# Altium schematic sheet BoardSchematic.SchDoc: Encoder DAQ
size A4; Date: March 16, 2022; Author: NIschay Joshi; CompanyName: UBC ECE; Revision: 1.0; SheetNumber: 1; SheetTotal: 1
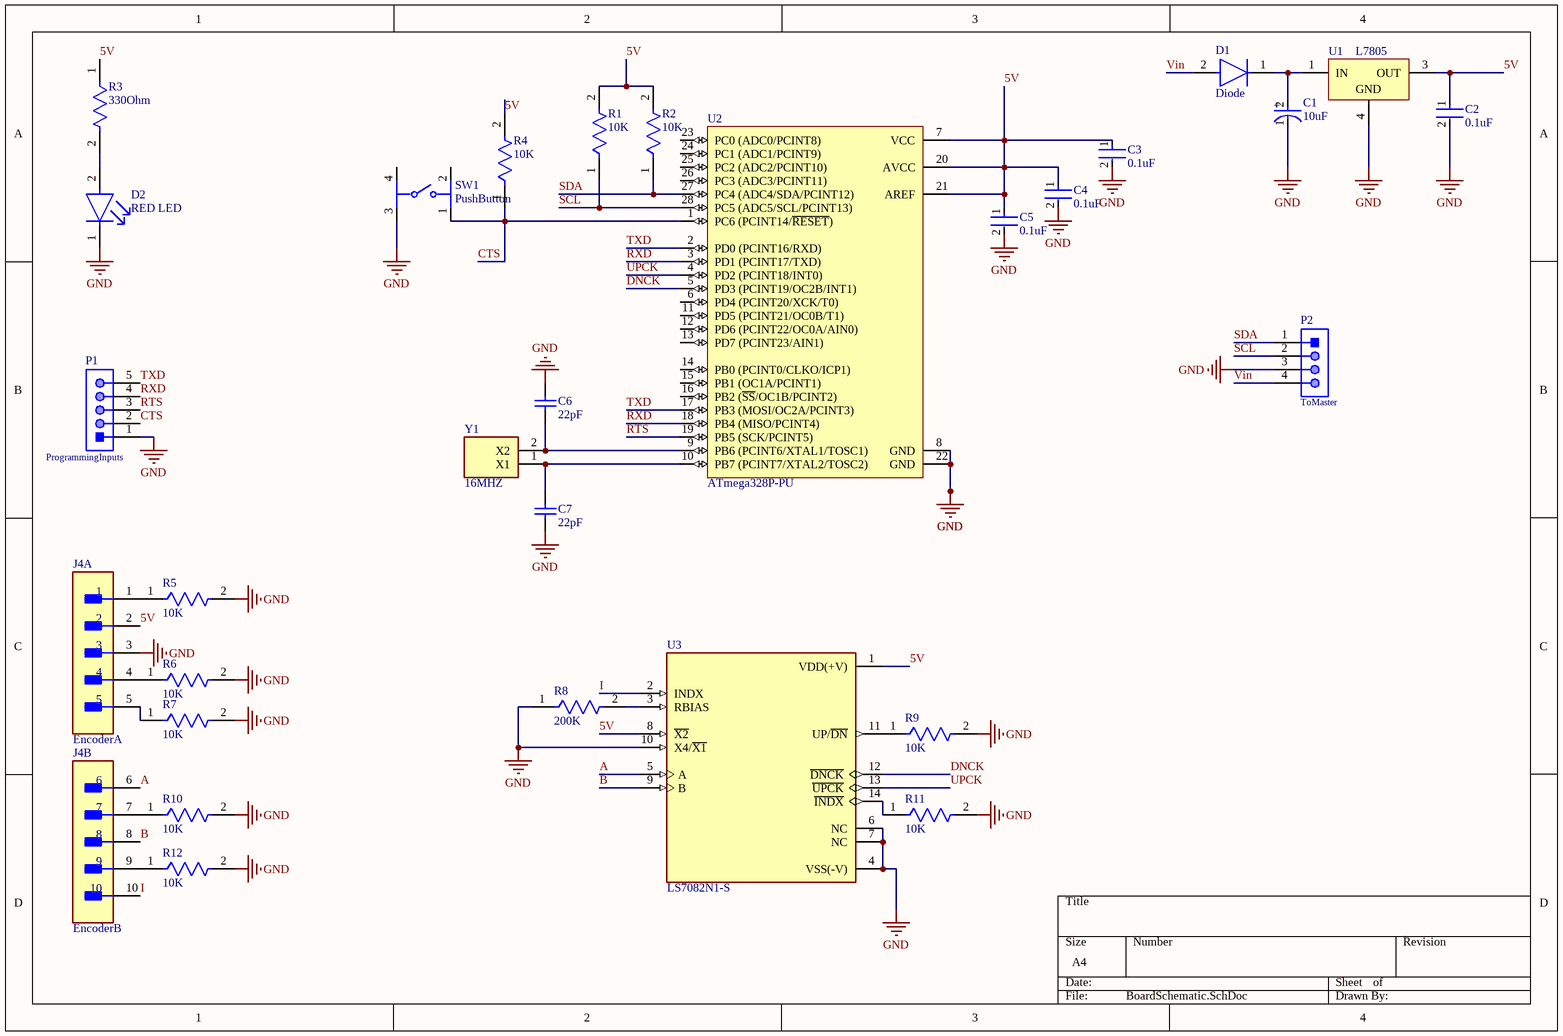
[diagram p0: BoardSchematic.SchDoc]

## Parts
C1  10uF  [FP-FKC-MFG]
C2  0.1uF  [FP-C322C104K5R5TA-MFG]
C3  0.1uF  [FP-K15H5-MFG]
C4  0.1uF  [FP-K15H5-MFG]
C5  0.1uF  [FP-K15H5-MFG]
C6  22pF  [KEMT-C315-THT-2]
C7  22pF  [KEMT-C315-THT-2]
D1  Diode  [FP-UF4007-MFG]
D2  RED LED  [FP-HLMP-1301-MFG]
J4  EncoderA  [FP-1722981210-MFG]  (parts A,B of 2)
P1  ProgrammingInputs  [691321100005]
P2  ToMaster  [61300411021]
R1  10K  [FP-CRCW2512-e3-IPC_A]
R2  10K  [FP-CRCW2512-e3-IPC_A]
R3  330Ohm  [FP-CRCW2010-e3-MFG]
R4  10K  [FP-CRCW2512-e3-IPC_A]
R5  10K  [FP-CRCW2512-e3-IPC_A]
R6  10K  [FP-CRCW2512-e3-IPC_A]
R7  10K  [FP-CRCW2512-e3-IPC_A]
R8  200K  [FP-CRCW2512-e3-IPC_B]
R9  10K  [FP-CRCW2512-e3-IPC_A]
R10  10K  [FP-CRCW2512-e3-IPC_A]
R11  10K  [FP-CRCW2512-e3-IPC_A]
R12  10K  [FP-CRCW2512-e3-IPC_A]
SW1  PushButton  [FP-FSM103-MFG]
U1  L7805  [TO-263_M]
U2  ATmega328P-PU  [28P3]
U3  LS7082N1-S  [SOIC127P600X175-14N]
Y1  16MHZ  [ABL16000MHZB2]

## Nets
GND: C1.1(C) C2.2 C3.2 C4.2 C5.2 C6.2 C7.1 D2.1(C) J4.3 P1.1 P2.3 R5.2 R6.2 R7.2 R8.1 R9.2 R10.2 R11.2 R12.2 SW1.3 U1.4(GND) U2.8(GND) U2.22(GND) U3.4(VSS(-V)) U3.6(NC) U3.7(NC) U3.10(X4/~{X1})
5V: C2.1 C3.1 C4.1 C5.1 J4.2 R1.2 R2.2 R3.1 R4.2 U1.3(OUT) U2.7(VCC) U2.20(AVCC) U2.21(AREF) U3.1(VDD(+V)) U3.8(~{X2})
A: J4.6 U3.5(A)
B: J4.8 U3.9(B)
CTS: P1.2 R4.1 SW1.1 U2.1(PC6_(PCINT14/~{RESET}))
DNCK: U2.5(PD3_(PCINT19/OC2B/INT1)) U3.12(~{DNCK})
I: J4.10 U3.2(INDX)
RTS: P1.3 U2.19(PB5_(SCK/PCINT5))
RXD: P1.4 U2.3(PD1_(PCINT17/TXD)) U2.18(PB4_(MISO/PCINT4))
SCL: P2.2 R1.1 U2.28(PC5_(ADC5/SCL/PCINT13))
SDA: P2.1 R2.1 U2.27(PC4_(ADC4/SDA/PCINT12))
TXD: P1.5 U2.2(PD0_(PCINT16/RXD)) U2.17(PB3_(MOSI/OC2A/PCINT3))
UPCK: U2.4(PD2_(PCINT18/INT0)) U3.13(~{UPCK})
Vin: D1.2(A) P2.4
NetC1_2: C1.2(A) D1.1(C) U1.1(IN)
NetC6_1: C6.1 U2.9(PB6_(PCINT6/XTAL1/TOSC1)) Y1.2(X2)
NetC7_2: C7.2 U2.10(PB7_(PCINT7/XTAL2/TOSC2)) Y1.1(X1)
NetD2_2: D2.2(A) R3.2
NetJ4_1: J4.1 R5.1
NetJ4_4: J4.4 R6.1
NetJ4_5: J4.5 R7.1
NetJ4_7: J4.7 R10.1
NetJ4_9: J4.9 R12.1
NetR8_2: R8.2 U3.3(RBIAS)
NetR9_1: R9.1 U3.11(UP/~{DN})
NetR11_1: R11.1 U3.14(~{INDX})

Not connected (* = marked no-connect by the designer): SW1 2 4; U2 6(PD4_(PCINT20/XCK/T0)) 11(PD5_(PCINT21/OC0B/T1)) 12(PD6_(PCINT22/OC0A/AIN0)) 13(PD7_(PCINT23/AIN1)) 14(PB0_(PCINT0/CLKO/ICP1)) 15(PB1_(OC1A/PCINT1)) 16(PB2_(~{SS}/OC1B/PCINT2)) 23(PC0_(ADC0/PCINT8)) 24(PC1_(ADC1/PCINT9)) 25(PC2_(ADC2/PCINT10)) 26(PC3_(ADC3/PCINT11))

## Notes on the sheet
- (in symbol CMP-05427-000030-1) +

## Library data of the parts
C1 = CMP-05427-000030-1: CAP ALUM 10UF 20% 50V SMD; Impedance: 1.52R; Ripple Current (AC): 85mA; Life (Hours): 2000Hour; Leakage Current: 3uA; Dielectric Material: Aluminium; Length: 5.8mm; Voltage Rating: 50V; Radiation Hardening: No; Max Operating Temperature: 105°C; REACH SVHC: No SVHC; Tolerance: 20%; RoHS Compliant: Yes; Case/Package: Radial; Height: 5.8mm; Voltage: 50V; Diameter: 5mm; Number of Pins: 2; Ripple Current: 85mA; Series: FK; Lead Free: Lead Free; Width: 6.5mm; ESR (Equivalent Series Resistance): 1.52R; Package Quantity: 1000; Construction: Cylindrical; Voltage Rating (DC): 50V; Packaging: Tape and Reel; Height - Seated (Max): 0.228inch; Contact Plating: Tin; Capacitance: 10uF; Min Operating Temperature: -55°C; Termination: SMD/SMT; Material: Aluminium; Mount: Surface Mount
C2 = CMP-03020-034661-1: CAP CER 0.1UF 50V X7R RADIAL; Capacitance: 100nF; Dielectric Material: Ceramic; Dissipation Factor: 2.5%; Lead Length: 7mm; Tolerance: 10%; Lead Diameter: 0.51mm; Lead/Base Style: Formed Leads; Construction: RADIAL; RoHS Compliant: Yes; Voltage Rating (DC): 50V; Packaging: Bulk; Lead Free: Lead Free; Width: 0.125inch; Lead Pitch: 5.08mm; Voltage Rating: 50V; Number of Pins: 2; Radiation Hardening: No; Material: Ceramic; REACH SVHC: No SVHC; Height - Seated (Max): 0.26inch; Case/Package: Radial; Weight: 0.0625lb; Dielectric: X7R; Min Operating Temperature: -55°C; Voltage: 50V; Series: Golden Max™; Max Operating Temperature: 125°C; Height: 3.18mm; Termination: Radial; Length: 5.08mm; Depth: 3.18mm; Package Quantity: 500; Mount: Through Hole
C3-C5 = CMP-02417-000048-1: CAP CER 0.1UF 50V X7R RADIAL; Capacitance: 100nF; Tolerance: 10%; Lead/Base Style: Formed Leads; Lead Length: 30mm; Lead Diameter: 0.5mm; Radiation Hardening: No; Lead Pitch: 5mm; Voltage: 50V; Mount: Through Hole; Package Quantity: 5000; Series: K; Case/Package: Dipped; Min Operating Temperature: -55°C; Depth: 2.5mm; Height - Seated (Max): 0.1inch; Voltage Rating (DC): 50V; Packaging: Bulk; RoHS Compliant: Yes; Construction: RADIAL; Thickness: 2.6mm; Max Operating Temperature: 125°C; Voltage Rating: 50V; Diameter: 500um; Dielectric: X7R; Width: 2.5mm; Length: 4mm; Weight: 0.005644oz; Termination: Radial; Height: 4mm
C6 C7 = CMP-1664-00008-1: Capacitor, Ceramic, 22 pF, +/-10 %, 100 V, -55 to 125 degC, 2-Pin THD, RoHS, Bulk; Max Input Voltage: 40 V; Min Input Voltage: 4.2 V; Output Current: 1.5 A; Output Voltage: 1.2 V; Outputs: 1; Case\Package: TO-220; RoHSCompliant: true; Min Operating Temperature: 0 degC; Max Operating Temperature: 125 degC; Package Quantity: 50; ComponentLink2URL: http://capacitoredge.kemet.com/capedge2/DataSheet/Datasheet-C315C220K1G5TA.pdf?pn=C315C220K1G5TA{BULK}; Radiation Hardening: No; Pins: 3; Length: 10.28 mm; ComponentLink1URL: http://www.kemet.com/; ComponentLink2Description: Datasheet; Height: 9.28 mm; REACH SVHC: No SVHC; ComponentLink1Description: Manufacturer URL; Max Ouput Current: 1.5 A; Weight: 0.08113 oz; Packaging: Rail/Tube; DatasheetVersion: Aug-16; Mount: Through Hole; PackageReference: C315-THT-2; Width: 4.82 mm; PackageDescription: 2-Pin Through Hole Device, Body 3.81 x 2.54 mm
D1 = CMP-02540-000043-1: DIODE GEN PURP 1KV 1A DO204AL; Manufacturer: Vishay; Manufacturer Part Number: UF4007-E3/54; Max Junction Temp: +150°C; Max Repetitive Reverse Voltage: 1000V; Max Surge Forward Current: 30A; Capacitance: 17pF; Peak Reverse Current: 10uA; Value: 17pF; Package: UF4007; Height: 2.7mm; RoHS: TRUE; Device Class L3: Rectifier Diodes; Temperature Range Low: -55°C; Ipc Land Pattern Name: DIOPA1088W105L520D270; Temperature: -55°C to +150°C; Category: Diode; Device Class L2: Diodes; Device Class L1: Discrete Semiconductors; Digikey Description: DIODE GEN PURP 1KV 1A DO204AL; Octopart: https://octopart.com/uf4007-e3%2F54-vishay-42333894; Mouser Description: Rectifiers Vr/1000V Io/1A; ComponentLink2URL: http://www.vishay.com/docs/88755/uf4001.pdf; Lead Free: Yes; Temperature Range High: +150°C; Automotive: No; ComponentLink2Description: Datasheet; Forward Current: 1A
D2 = CMP-18399-000007-1: LED RED DIFFUSED T-1 T/H; Manufacturer: Broadcom; Forward Current: 10mA; Max Junction Temp: +110°C; Wavelength: 626nm; Led Orientation: Straight; Viewing Angle: 60°; Luminous Intensity: 3.4mcd; Forward Voltage: 1.9V; Reverse Voltage: 5V; Peak Emmision Wavelength: 635nm; Mouser Description: Standard LEDs - Through Hole Red Diffused 635nm 3.4mcd; RoHS: TRUE; ComponentLink2Description: Datasheet; Device Class L1: Optoelectronics; Temperature Range High: +100°C; Manufacturer Part Number: HLMP-1301; ComponentLink2URL: https://docs.broadcom.com/docs/AV02-1555EN; Colour: Red; Digikey Description: LED RED DIFFUSED T-1 T/H; Automotive: No; Device Class L2: LEDs; Temperature Range Low: -40°C; Octopart: https://octopart.com/hlmp-1301-broadcom-71130345; Category: Diode; Lead Free: Yes; Device Class L3: unset; Package: 0; Temperature: -40°C to +100°C
J4 = CMP-04776-000117-1: CONN HEADER VERT 10POS 3.5MM; Manufacturer: Molex; Manufacturer Part Number: 1722981210; Current Rating: 11A; Conn Orientation: Vertical; Number Of Contacts: 10; Conn Gender: Male; Standoff Height: 0.35mm; Voltage Rating: 400V; ComponentLink2Description: Datasheet; Height: 14.5mm; Footprint Url: https://www.molex.com/pdm_docs/sd/1722981210_sd.pdf; Category: Conn; Lead Free: Yes; ComponentLink2URL: http://www.molex.com/webdocs/datasheets/pdf/en-us/1722981210_PCB_HEADERS.pdf; Device Class L1: Connectors; Device Class L3: unset; Temperature Range High: +120°C; Pitch: 3.5mm; Package: 0; Device Class L2: Headers and Wire Housings; Contact Material: Tin,Nickel; Automotive: No; Digikey Description: CONN HEADER VERT 10POS 3.5MM; Number Of Rows: 2; Temperature: -40°C to +120°C; Octopart: https://octopart.com/172298-1210-molex-60759931; Temperature Range Low: -40°C; RoHS: TRUE
P1 = CMP-1502-01786-1: Serie 3211 - 3.50mm Vertical PCB Header WR-TBL, 5 pin; Manufacturer: Wurth Elektronik; Pin Number: 5; Gender: Male; Datasheet URL: http://katalog.we-online.de/em/datasheet/6913211000xx.pdf; Package Reference: 691321100005; Manufacturer URL: http://www.we-online.de; Pitch: 3.50mm; Operating Temperature: -40to105degC; Publisher: WurthElektronik; Packaging: Box; Part Number: 691321100005; Mounting Technology: THT
P2 = CMP-1502-01063-1: THT Angled Pin Header WR-PHD, Pitch 2.54 mm, Single Row, 4 pins; Manufacturer: Wurth Elektronik; Gender: Male; Pin Number: 4; Withstanding Voltage: 500VAC; Working Voltage: 250VAC; Contact Resistance: 20mOhm; Pitch: 2.54mm; Rated Current: 3A; Manufacturer URL: http://www.we-online.de; Mounting Technology: THT; Publisher: WurthElektronik; Operating Temperature: -40to105degC; Packaging: Bag; Row Number: Single; Package Reference: 61300411021; Part Number: 61300411021; Orientation: Angled; Datasheet URL: https://katalog.we-online.de/em/datasheet/6130xx11021.pdf
R1 R2 R4-R7 R9-R12 = CMP-02407-002758-1: RES Thick Film, 10kΩ, 5%, 1W, 200ppm/°C, 2512; Resistance: 10kR; Voltage Rating: 500V; Termination: SMD/SMT; Weight: 0.001429oz; Number of Terminations: 2; Package Quantity: 1; Case/Package: 2512; Length: 6.3mm; Temperature Coefficient: 200ppm/°C; Packaging: Tape and Reel; Voltage Rating (DC): 500V; Case Code (Imperial): 2512; Max Operating Temperature: 155°C; Number of Pins: 2; Height: 0.028inch; Military Standard: Not; Lead Free: Lead Free; Min Operating Temperature: -55°C; Features: Automotive AEC-Q200; Contact Plating: Tin; Depth: 3.15mm; Mount: Surface Mount; REACH SVHC: No SVHC; Composition: Thick Film; Radiation Hardening: No; Max Power Dissipation: 1W; Case Code (Metric): 6432; Power Rating: 1W; Width: 0.124inch; Tolerance: 5%
R3 = CMP-1017-00062-2: RES Thick Film, 330Ω, 5%, 0.75W, 200ppm/°C, 2010; Resistance: 330R; Voltage Rating: 400V; Max Power Dissipation: 750mW; Width: 2.5mm; Number of Terminations: 2; Termination: SMD/SMT; Contact Plating: Tin; Package Quantity: 4000; Weight: 0.000899oz; Radiation Hardening: No; Case Code (Metric): 5025; Features: Automotive AEC-Q200; Length: 5mm; Min Operating Temperature: -55°C; Case/Package: 2010; Temperature Coefficient: 200ppm/°C; Max Operating Temperature: 155°C; Lead Free: Lead Free; Height: 0.6mm; Composition: Thick Film; Packaging: Tape and Reel; Tolerance: 5%; Power Rating: 750mW; Military Standard: Not; Depth: 2.5mm; Voltage Rating (DC): 400V; Case Code (Imperial): 2010
R8 = CMP-02407-005119-1: RES Thick Film, 200kΩ, 5%, 1W, 200ppm/°C, 2512; Voltage Rating: 500V; Resistance: 200kR; Mount: Surface Mount; Case/Package: 2512; Width: 3.15mm; Lead Free: Lead Free; Height: 0.028inch; Weight: 0.001429oz; Length: 6.3mm; Number of Pins: 2; Contact Plating: Tin; Min Operating Temperature: -55°C; Power Rating: 1W; Features: Automotive AEC-Q200; Tolerance: 5%; Package Quantity: 1; Case Code (Metric): 6432; Temperature Coefficient: 200ppm/°C; Composition: Thick Film; Radiation Hardening: No; Case Code (Imperial): 2512; Voltage Rating (DC): 500V; Max Power Dissipation: 1W; Number of Terminations: 2; Max Operating Temperature: 155°C; Packaging: Tape and Reel
SW1 = CMP-03407-000037-1: SWITCH TACTILE SPST-NO 0.05A 24V; Contact Resistance: 100mR; Actuator Length: 3.4mm; Switch Function: Off-Mom; Operating Force: 1.57N; Illumination Type: Non-Illuminated; Voltage Rating (DC): 12V; Current Rating: 50mA; Actuator Material: Polyester; Switch Travel: 0.3mm; Throw Configuration: SPST; Actuator Color: Black; Mechanical Life: 100000Cycles; Depth: 14.1mm; RoHS Compliant: Yes; Max Operating Temperature: 85°C; Mount: Through Hole; Min Operating Temperature: -35°C; Contact Plating: Silver; Width: 12mm; Package Quantity: 400; Radiation Hardening: No; Series: FSM100 ~ 104; Type: Switch; Termination: PC Pins; Voltage Rating: 24V; Contact Material: Brass; Max Voltage Rating (DC): 12V; Contact Current Rating: 50mA; Length: 12mm; Packaging: Loose Piece; Orientation: Straight; Max Current Rating: 50mA; Electrical Life: 100000Cycles
U1 = CMP-0244-00213-1: Positive Voltage Regulator, 3-Pin D2PAK, Tape and Reel; PackageReference: TO-263; ComponentLink2URL: http://www.st.com/internet/com/TECHNICAL_RESOURCES/TECHNICAL_LITERATURE/DATASHEET/CD00000444.pdf; PackageDescription: 3-Pin Transistor Outline Package 2.54 mm Pitch, 15.4 mm Lead Span (D2PAK); DatasheetVersion: 16/11/2011; ComponentLink2Description: Datasheet; ComponentLink1Description: Manufacturer URL; PackageVersion: 2011; ComponentLink1URL: http://www.st.com
U2 = CMP-0095-00013-2: 8-bit AVR Microcontroller, 32KB Flash, 1KB EEPROM, 2KB SRAM, 28-pin PDIP, Industrial Grade (-40°C to 85°C); RevisionNote: DatasheetVersion updated. URLs added.; PackageVersion: revB, Sep-2001; PackageDescription: 28-lead (0.300"/7.62mm Wide) Plastic Dual Inline Package (PDIP); DatasheetVersion: revD, May-2011; ComponentLink1Description: Manufacturer URL; ComponentLink1URL: http://www.atmel.com/; PackageReference: 28P3; ComponentLink2Description: ATmega48A/48PA/88A/88PA/168A/168PA/328/328P Datasheet; ComponentLink3URL: http://www.atmel.com/dyn/resources/prod_documents/8271S.pdf; ComponentLink2URL: http://www.atmel.com/dyn/resources/prod_documents/8271.pdf; ComponentLink3Description: ATmega48A/48PA/88A/88PA/168A/168PA/328/328P Summary
U3 = LS7082N1-S: MF: {'manufacturer': u'LSI/CSI'}; MP: LS7082N1-S; Availability: Unavailable; Value: *; Price: None; Package: None
Y1 = ABL-16.000MHZ-B2: Crystal or Oscillator; Manufacturer_Name: ABRACON; Datasheet Link: http://www.abracon.com/Resonators/ABL.pdf; Height: 3.5mm; Manufacturer_Part_Number: ABL-16.000MHZ-B2; Mouser Part Number: 815-ABL-16-B2; Mouser Price/Stock: https://www.mouser.co.uk/ProductDetail/ABRACON/ABL-16000MHZ-B2?qs=A7YjigRBFZlH19Ss3q%252BAbA%3D%3D; Arrow Part Number: ABL-16.000MHZ-B2; Arrow Price/Stock: https://www.arrow.com/en/products/abl-16.000mhz-b2/abracon